# EAGLE design sentinel psionic (EAGLE 9.2.0)
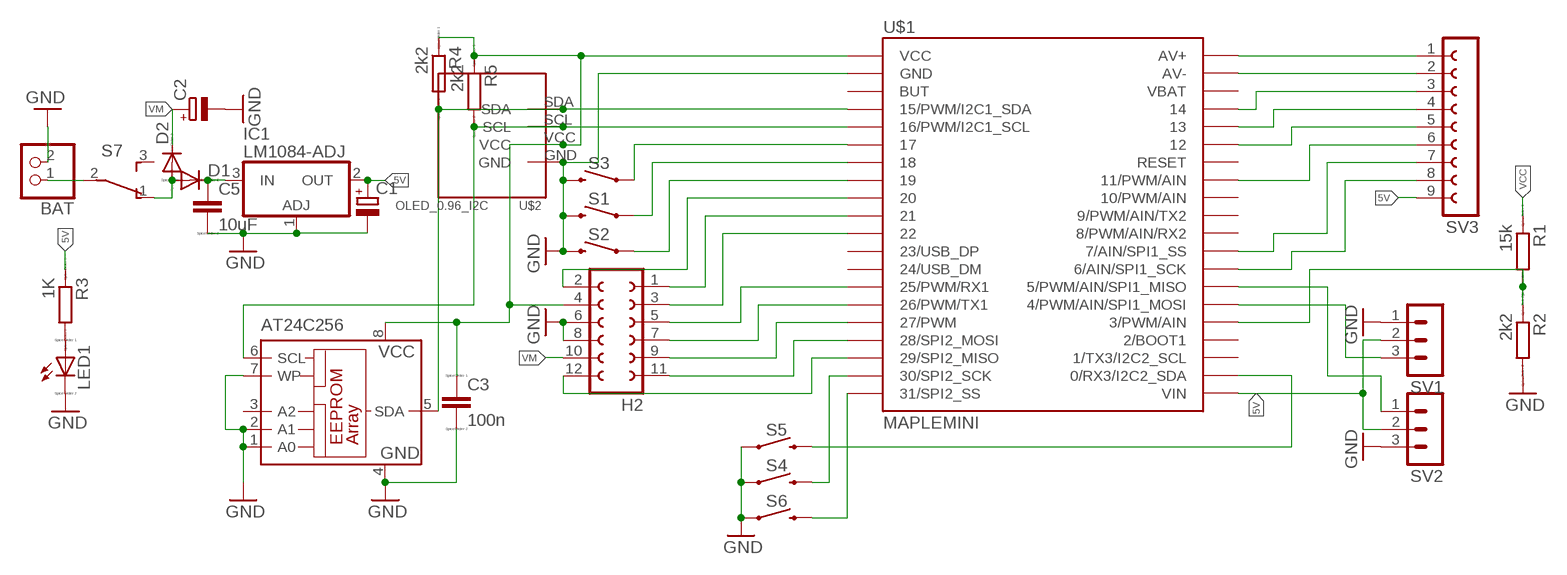
[diagram p0: schematic, sheet 1]

## Parts
AT24C256  24AA01SN  [SO-08]
BAT  PINHD-1X2  [1X02]
C1  CPOL-EU153CLV-0605  [153CLV-0605]
C2  CPOL-EU153CLV-0605  [153CLV-0605]
C3  100n  CC1206  [C1206]
C5  10uF  CC1206  [C1206]
D1  DIODE-DO-214AC  [DO-214AC]
D2  DIODE-DO-214AC  [DO-214AC]
H2  FE06-2  [FE06-2]
IC1  LM1084-ADJ  [TO263-3]
LED1  LED_E  [LED_1206]
R1  15k  RR1206  [R1206]
R2  2k2  RR1206  [R1206]
R3  1K  RR1206  [R1206]
R4  2k2  RR1206  [R1206]
R5  2k2  RR1206  [R1206]
S1  MOMENTARY-SWITCH-SPST-SMD-6.0X3.5MM  [TACTILE_SWITCH_SMD_6.0X3.5MM]
S2  MOMENTARY-SWITCH-SPST-SMD-6.0X3.5MM  [TACTILE_SWITCH_SMD_6.0X3.5MM]
S3  MOMENTARY-SWITCH-SPST-SMD-6.0X3.5MM  [TACTILE_SWITCH_SMD_6.0X3.5MM]
S4  MOMENTARY-SWITCH-SPST-SMD-6.0X3.5MM  [TACTILE_SWITCH_SMD_6.0X3.5MM]
S5  MOMENTARY-SWITCH-SPST-SMD-6.0X3.5MM  [TACTILE_SWITCH_SMD_6.0X3.5MM]
S6  MOMENTARY-SWITCH-SPST-SMD-6.0X3.5MM  [TACTILE_SWITCH_SMD_6.0X3.5MM]
S7  TL36PO  [TL3XPO]
SV1  MA03-1  [MA03-1]
SV2  MA03-1  [MA03-1]
SV3  FE09-1  [FE09]
U$1  MAPLEMINI  [20-DIP]
U$2  OLED_0.96_I2C  [OLED_0.96_I2C]

## Nets
5V: C1.+ IC1.2(OUT) R3.1 SV1.2 SV2.2 SV3.9 U$1.21(VIN)
5V1: AT24C256.8(VCC) C3.1 H2.4 R4.1 R5.1 U$1.1(VCC) U$2.VCC
+: BAT.1 S7.2(P)
GND: AT24C256.1(A0) AT24C256.2(A1) AT24C256.4(GND) AT24C256.7(WP) BAT.2 C1.- C2.- C3.2 C5.2 H2.6 H2.8 IC1.1(ADJ) LED1.C R2.2 S1.2 S2.2 S3.2 S4.1 S5.1 S6.1 SV1.1 SV2.3 U$1.2(GND) U$2.GND
N$1: R1.2 R2.1 U$1.25(3/PWM/AIN)
N$2: AT24C256.5(SDA) R4.2 U$1.4(15/PWM/I2C1_SDA) U$2.SDA
N$3: LED1.A R3.2
N$4: SV3.8 U$1.28(6/AIN/SPI1_SCK)
N$5: SV3.1 U$1.40(AV+)
N$6: SV3.2 U$1.39(AV-)
N$7: SV3.3 U$1.37
N$8: SV3.4 U$1.36
N$9: SV3.5 U$1.35
N$10: SV3.6 U$1.33(11/PWM/AIN)
N$11: SV3.7 U$1.29(7/AIN/SPI1_SS)
N$17: S3.1 U$1.6
N$18: S1.1 U$1.7
N$19: S2.1 U$1.8
N$20: S6.2 U$1.20(31/SPI2_SS)
N$21: S4.2 U$1.19(30/SPI2_SCK)
N$22: S5.2 U$1.22(0/RX3/I2C2_SDA)
N$24: C5.1 D1.C IC1.3(IN)
N$25: H2.2 U$1.9
N$26: SV2.1 U$1.27(5/PWM/AIN/SPI1_MISO)
N$27: SV1.3 U$1.26(4/PWM/AIN/SPI1_MOSI)
N$28: H2.1 U$1.10
N$29: H2.11 U$1.17(28/SPI2_MOSI)
N$30: H2.12 U$1.18(29/SPI2_MISO)
N$31: H2.3 U$1.11
N$32: H2.5 U$1.14(25/PWM/RX1)
N$33: H2.7 U$1.15(26/PWM/TX1)
N$34: H2.9 U$1.16(27/PWM)
N$36: AT24C256.6(SCL) R5.2 U$1.5(16/PWM/I2C1_SCL) U$2.SCL
VCC: D1.A D2.A R1.1 S7.1(O)
VM: C2.+ D2.C H2.10
Unconnected: AT24C256.3(A2) S7.3(S) U$1.3(BUT) U$1.12(23/USB_DP) U$1.13(24/USB_DM) U$1.23(1/TX3/I2C2_SCL) U$1.24(2/BOOT1) U$1.30(8/PWM/AIN/RX2) U$1.31(9/PWM/AIN/TX2) U$1.32(10/PWM/AIN) U$1.34(RESET) U$1.38(VBAT)

## Library data of the parts
AT24C256 = microchip:24*: Serial EEPROM I2C; MF: MICROCHIP; MPN: 24AA01/SN; OC_FARNELL: 1331268; OC_NEWARK: 89C9792
BAT = pinhead:PINHD-1X2: PIN HEADER
C1 C2 = resistor:CPOL-EU: POLARIZED CAPACITOR, European symbol
C3 C5 = eagle-ltspice:C: CAPACITOR, European symbol; SPICEMODEL: NONE; SPICEPREFIX: C
D1 D2 = diode:DIODE-: DIODE
H2 = con-lsta:FE06-2: FEMALE HEADER; OC_FARNELL: unknown; OC_NEWARK: unknown
IC1 = lm1084:LM1084-ADJ: LM1084-ADJ 5A 29V - Voltage Regulator Autor: Cleber Moretti Web site: http://www.binarycodec.blogspot.com v.1.2
LED1 = eagle-ltspice:LED_E: LED Source: http://www.osram.convergy.de Source: www.luxeon.com Source: www.kingbright.com; SPICEMODEL: NONE; SPICEPREFIX: D; SPICETYPE: diode
R1-R5 = eagle-ltspice:R: RESISTOR, European symbol; SPICEMODEL: NONE; SPICEPREFIX: R
S1-S6 = button:MOMENTARY-SWITCH-SPST: Momentary Switch (Pushbutton) - SPST Normally-open (NO) SPST momentary switches (buttons, pushbuttons). Variants PTH-12MM - 12mm square, through-hole Momentary Pushbutton Switch - 12mm Square <https://www.sparkfun.com/products/9190> (COM-09190) PTH-6.0MM, PTH-6.0MM-KIT - 6.0mm square, through-hole Mini Pushbutton Switch <https://www.sparkfun.com/products/97> (COM-00097) KIT package intended for soldering kit's - only one side of pads' copper is exposed. PTH-RIGHT-ANGLE-KIT - Right-angle, through-hole Right Angle Tactile Button <https://www.sparkfun.com/products/10791> - Used on SparkFun BigTime Watch Kit <https://www.sparkfun.com/products/11734> SMD-12MM - 12mm square, surface-mount Tactile Button - SMD (12mm) <https://www.sparkfun.com/products/12993> (COM-12993) Used on SparkFun PicoBoard <https://www.sparkfun.com/products/11888> SMD-4.5MM - 4.5mm Square Trackball Switch Used on SparkFun Blackberry Trackballer Breakout <https://www.sparkfun.com/products/13169> SMD-4.6MMX2.8MM - 4.60mm x 2.80mm, surface mount Used on SparkFun SAMD21 Mini Breakout <https://www.sparkfun.com/products/13664> SMD-5.2MM, SMD-5.2-REDUNDANT - 5.2mm square, surface-mount Mini Pushbutton Switch - SMD <https://www.sparkfun.com/products/8720> (COM-08720) Used on Arduino Pro Mini <https://www.sparkfun.com/products/11114> REDUNDANT package connects both switch circuits together SMD-6.0X3.5MM - 6.0 x 3.5mm, surface mount Momentary Reset Switch SMD <https://www.sparkfun.com/products/8229> (COM-08229) SMD-6.2MM-TALL - 6.2mm square, surface mount Tactile Button - SMD (6mm) <https://www.sparkfun.com/products/12992> Used on SparkFun Digital Sandbox <https://www.sparkfun.com/products/12651> SMD-RIGHT-ANGLE - Right-angle, surface mount Used on SparkFun Block for Intel� Edison - Arduino <https://www.sparkfun.com/products/13036>; PROD_ID: SWCH-00815; SF_SKU: COM-08229
S7 = switch:TL36PO: TINY SWITCH ON - ON Source: http://www2.produktinfo.conrad.com/datenblaetter/700000-724999/705152-da-01-de-Subminiaturschalter_TL_36YO.pdf
SV1 SV2 = con-lstb:MA03-1: PIN HEADER; OC_FARNELL: unknown; OC_NEWARK: unknown
SV3 = con-lsta:FE09-1: FEMALE HEADER; OC_FARNELL: unknown; OC_NEWARK: unknown
U$1 = maplemini:MAPLEMINI
U$2 = oled_0.96:OLED_0.96_I2C

## Board
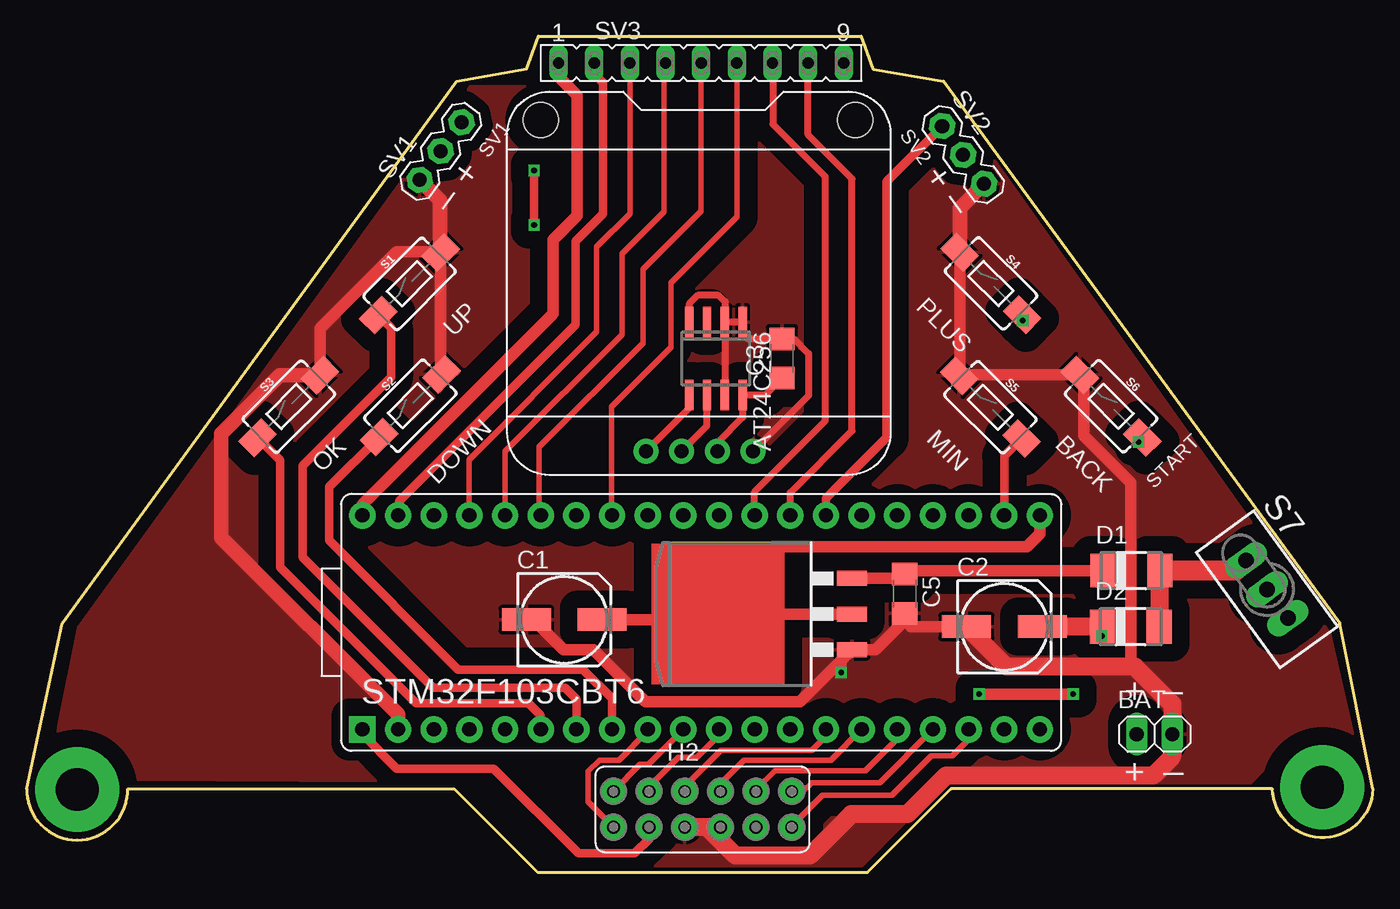
[diagram p1: board, top side]
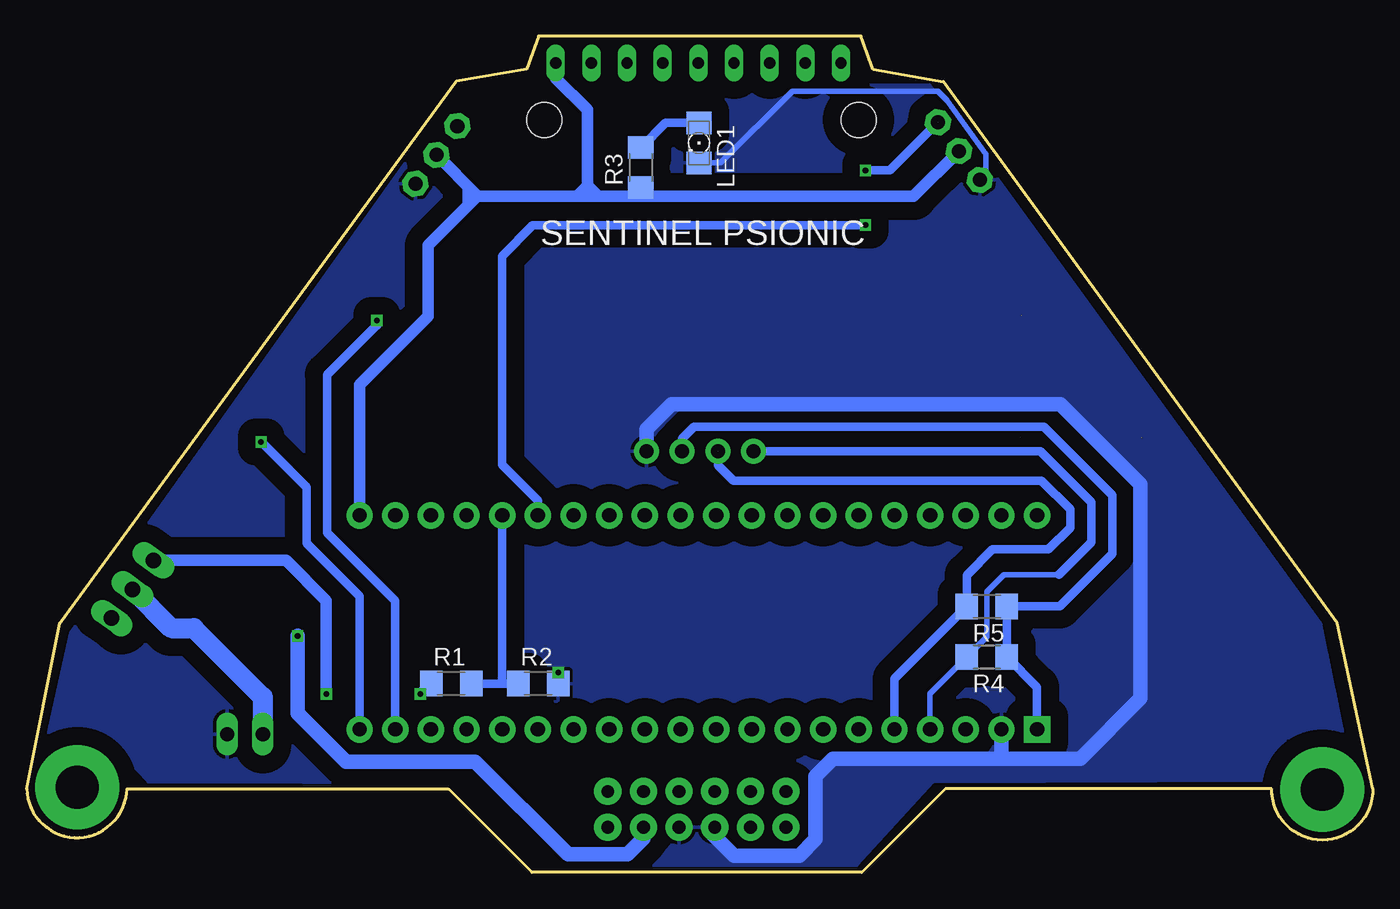
[diagram p2: board, bottom side, seen from below]

No outline drawn. Coordinates in mm, seen from the top.
Copper layers (1*16): Top 0.035mm / dielectric 1.5mm / Bottom 0.035mm
Design rules "default": minimum track width 10mil, minimum drill 24mil, track to track 8mil, track to pad 8mil, pad to pad 8mil, via to via 8mil, smd to smd 8mil, copper to edge 40mil, drill to drill 8mil, minimum pad ring 10mil, minimum via ring 8mil, stop-mask expansion 4mil, vias tented up to drill 0mil, thermal gap 10mil
Milling: 16 lines

### Footprints (pad centres in the part's own frame; a part is rotated, then mirrored left to right if it is on the bottom)
SO-08 = smd 0.6 x 2.2: 1 -1.905,-2.6; 2 -0.635,-2.6; 3 0.635,-2.6; 4 1.905,-2.6; 5 1.905,2.6; 6 0.635,2.6; 7 -0.635,2.6; 8 -1.905,2.6
1X02 = drill 1.016 long: 1 -1.27,0; 2 1.27,0
153CLV-0605 = smd 3.5 x 1.6: + 2.7,0; - -2.7,0
C1206 = smd 1.6 x 1.8: 1 -1.4,0; 2 1.4,0
DO-214AC = smd 1.8 x 2.4: A 2.025,0; C -2.025,0
FE06-2 = drill 0.914 pad 1.93: 1 -6.35,1.27; 2 -6.35,-1.27; 3 -3.81,1.27; 4 -3.81,-1.27; 5 -1.27,1.27; 6 -1.27,-1.27; 7 1.27,1.27; 8 1.27,-1.27; 9 3.81,1.27; 10 3.81,-1.27; 11 6.35,1.27; 12 6.35,-1.27
TO263-3 = smd 1.067 x 2.159: 1 -2.54,-5.791; 2 0,-5.791; 3 2.54,-5.791
LED_1206 = smd 1.6 x 1.803: A -1.422,0; C 1.422,0
R1206 = smd 1.6 x 1.803: 1 -1.422,0; 2 1.422,0
TACTILE_SWITCH_SMD_6.0X3.5MM = smd 2.3 x 1.6: 1 -3.15,0; 2 3.15,0
TL3XPO = drill 1.1 pad 1.422 long: 1 -2.54,0; 2 0,0; 3 2.54,0
MA03-1 = drill 1 pad 1.8 octagon: 1 -2.54,0; 2 0,0; 3 2.54,0
FE09 = drill 0.813 long: 1 -10.16,0; 2 -7.62,0; 3 -5.08,0; 4 -2.54,0; 5 0,0; 6 2.54,0; 7 5.08,0; 8 7.62,0; 9 10.16,0
20-DIP = drill 1.016 pad 1.88 square: 1 -24.13,-7.62 | drill 1.016 pad 1.88: 2 -21.59,-7.62; 3 -19.05,-7.62; 4 -16.51,-7.62; 5 -13.97,-7.62; 6 -11.43,-7.62; 7 -8.89,-7.62; 8 -6.35,-7.62; 9 -3.81,-7.62; 10 -1.27,-7.62; 11 1.27,-7.62; 12 3.81,-7.62; 13 6.35,-7.62; 14 8.89,-7.62; 15 11.43,-7.62; 16 13.97,-7.62; 17 16.51,-7.62; 18 19.05,-7.62; 19 21.59,-7.62; 20 24.13,-7.62; 21 24.13,7.62; 22 21.59,7.62; 23 19.05,7.62; 24 16.51,7.62; 25 13.97,7.62; 26 11.43,7.62; 27 8.89,7.62; 28 6.35,7.62; 29 3.81,7.62; 30 1.27,7.62; 31 -1.27,7.62; 32 -3.81,7.62; 33 -6.35,7.62; 34 -8.89,7.62; 35 -11.43,7.62; 36 -13.97,7.62; 37 -16.51,7.62; 38 -19.05,7.62; 39 -21.59,7.62; 40 -24.13,7.62
OLED_0.96_I2C = drill 1 pad 1.778: GND -4.17,11.63; SCL 0.91,11.63; SDA 3.45,11.63; VCC -1.63,11.63 | hole 2.5: -11.47,-11.97; 10.93,-11.97

### Placement (x,y rotation side)
AT24C256  61.3,36 180 top
BAT  92.55,9.25 0 top
C1  50.5,17.4 0 top
C2  81.85,16.9 0 top
C3  66,36 90 top
C5  74.75,19.25 270 top
D1  90.9,20.9 0 top
D2  90.85,16.9 0 top
H2  60.35,3.9 0 top
IC1  65.2,17.8 90 top
LED1  60.2,51.35 270 bottom
R1  77.85,12.85 0 bottom
R2  71.65,12.85 0 bottom
R3  64.35,49.6 90 bottom
R4  39.7,14.75 180 bottom
R5  39.7,18.35 180 bottom
S1  39.47,41.32 45 top
S2  39.53,32.64 45 top
S3  30.87,32.58 45 top
S4  80.9,41.34 315 top
S5  80.85,32.53 315 top
S6  89.45,32.6 315 top
S7  100.56,19.57 306 top
SV1  41.69,50.77 54 top
SV2  78.91,50.5 306 top
SV3  60.25,57.05 0 top
U$1  60.25,17.21 0 top
U$2  59.77,41.03 180 top

### Tracks (layer width: path | path; a pad name or v marks a point on that pad's centre or on a via)
5V
  Top 0.813: U$1.21 84.38,23.53 83.45,22.6 65.35,22.6 65.35,18.15 | IC1.2 65.7,17.8 65.35,18.15 | C1.+ 64.6,17.4 65.35,18.15
  Bottom 0.61: 76.75,48.3 76.75,46.8 | R3.1 64.35,47.7 64.5,47.55 | 67.25,47.55 68.15,48.45 69.05,47.55
  Bottom 0.813: SV1.2 44.91,47.55 64.5,47.55 67.25,47.55 68.25,47.55 | SV2.2 76,47.59 76,47.55 | 68.25,47.55 69.05,47.55 76,47.55 | U$1.21 84.38,34.12 79.5,39 79.5,44.05 76.75,46.8 76,47.55 | SV3.9 70.41,55.96 68.15,53.7 68.15,48.45 68.15,47.65 68.25,47.55
5V1
  Top 0.508: C3.1 64.8,33.4 AT24C256.8 63.2,31.8 61.4,30 U$2.VCC
  Top 0.61: U$1.1 36.12,9.23 38.55,6.8 45.45,6.8 51.5,0.75 55.5,0.75 56.6,1.85 56.6,2.57 H2.4
  Bottom 0.61: U$2.VCC 61.4,30.3 60.55,31.15 35.65,31.15 30.75,26.25 30.75,22.1 34.5,18.35 R5.1 R4.1 36.12,12.59 U$1.1
+
  Bottom 1.422: BAT.1 91.28,11.88 96.2,16.8 97.79,16.8 S7.2
GND  (via drill 0.4)
  Top 0.508: AT24C256.2 AT24C256.1 63.2,37.8 63.6,37.4 C3.2 66.85,37.4 67.9,36.35 67.9,33.36 U$2.GND | AT24C256.4 59.4,39.9 60,40.5 61.5,40.5 61.95,40.05 61.95,38.62 AT24C256.2 | AT24C256.2 AT24C256.7
  Top 0.813: C5.2 74.75,17.35 | 74.75,17.35 72.65,15.25 71,15.25 | 71,15.25 IC1.1 | C2.- 75.2,16.9 74.75,17.35 | S4.1 78.67,34.81 S5.1 78.69,34.83 S6.1 87.5,34.55 87.5,30.5 90.85,27.15 90.85,14.05 | S2.2 41.7,34.93 S1.2 41.64,43.6 38.55,43.6 33.1,38.15 S3.2 | C1.- 48.3,17.4 50.45,15.25 52.6,15.25 56.3,11.55 67.28,11.55 IC1.1 71,15.25 | v70.22,13.63 70.22,14.46 71,15.25
  Top 1.016: S4.1 78.67,46.71 SV2.3 | 41.64,43.6 41.64,47.27 SV1.1 | S3.2 30.2,34.8 26.05,30.65 26.05,23.25 38.65,10.65 U$1.2
  Top 1.27: H2.8 H2.6 60.67,2.63 62.7,0.6 68,0.6 70.95,3.55 74.95,3.55 77.7,6.3 92.45,6.3 93.8,7.65 93.8,9.23 BAT.2 93.82,11.38 91.15,14.05 90.85,14.05 82,14.05 C2.-
  Bottom 0.406: LED1.C 58.67,49.93 53.55,55.05 43.2,55.05 42.55,54.4 39.75,50.55 39.75,49.16 SV1.1
  Bottom 0.61: R2.2 v70.23,13.62 v70.22,13.63
  Bottom 1.016: U$1.2 38.66,7.55 | 38.66,7.55 38.66,7.5 50.65,7.5 51.9,6.25 51.9,1.75 53.05,0.6 57.7,0.6 59.2,2.1 59.2,2.51 H2.6 | U$2.GND 63.94,30.96 62.15,32.75 34.45,32.75 28.75,27.05 28.75,11.8 33.05,7.5 38.61,7.5 38.66,7.55
  pour Top (isolate 1.27): 14.5,9.8 15.9,16.9 43.8,55.4 77.35,55.45 105,16.5 106.7,9.05 102.5,8.95 99.4,5.75 77.5,5.7 71.7,-0.15 48.95,-0.2 43.65,5.85 19.65,6 18.2,9 14.4,9.1
  pour Bottom (isolate 1.27): 48.95,-0.1 43.5,5.85 19.6,5.95 18.35,9 14.25,8.95 15.9,17.1 43.8,55.5 77.2,55.45 105,16.45 106.65,9.05 102.5,9.05 99.45,5.85 77.45,5.8 71.75,-0.1
N$1
  Bottom 0.61: 73.15,12.93 R2.1 74.35,12.85 | R1.2 74.35,12.85 | U$1.25 74.25,24.8 74.25,12.95 74.35,12.85
N$2
  Top 0.508: U$2.SDA 59.4,32.48 AT24C256.5
  Bottom 0.406: U$1.4 43.74,12.13 R4.2 39.7,16.17 39.7,19.4 38.5,20.6 34.55,20.6
  Bottom 0.61: 34.55,20.6 32.25,22.9 32.25,25.75 35.9,29.4 U$2.SDA
N$3
  Bottom 0.61: LED1.A 62.6,52.77 R3.2
N$4
  Top 0.508: U$1.28 66.6,26.45 71,30.85 71,48.8 67.87,51.93 SV3.8
N$5
  Top 0.813: U$1.40 36.12,25.62 49.7,39.2 49.7,44.45 51.4,46.15 51.4,54.75 50.1,56.05 SV3.1
N$6
  Top 0.61: U$1.39 38.75,24.92 38.75,25.85 51.3,38.4 51.3,44.35 53.25,46.3 53.25,55.65 52.75,56.15 52.75,56.93 SV3.2
N$7
  Top 0.406: SV3.3 55.17,46.32 52.8,43.95 52.8,37.9 43.7,28.8 43.7,24.87 U$1.37
N$8
  Top 0.406: U$1.36 46.28,29.38 54.6,37.7 54.6,43.45 57.6,46.45 57.6,56.94 SV3.4
N$9
  Top 0.406: SV3.5 60.25,46.5 56.1,42.35 56.1,37.1 48.7,29.7 48.7,24.95 U$1.35
N$10
  Top 0.406: SV3.6 62.79,46.09 58.1,41.4 58.1,36.8 53.85,32.55 53.85,24.88 U$1.33
N$11
  Top 0.406: 65.35,57.03 SV3.7
  Top 0.508: 65.35,57.03 65.35,52.7 69.1,48.95 69.1,31.55 64.06,26.51 U$1.29
N$17  (1 unrouted)
  Top 0.61: S3.1 30.25,28.74 30.25,21.15 39.95,11.45 47.95,11.45 48.82,10.58 U$1.6
N$18  (1 unrouted)
  Top 0.61: S1.1 38.15,38.18 38.15,34.65 31.85,28.35 31.85,21.85 41.15,12.55 50.55,12.55 51.36,11.74 U$1.7
N$19  (1 unrouted)
  Top 0.61: S2.1 33.75,26.86 33.75,23.95 33.75,23.05 42.95,13.85 51.85,13.85 53.9,11.8 U$1.8
N$20  (via drill 0.4)
  Top 0.61: v91.4,30.05 S6.2
  Bottom 0.61: v91.4,30.05 91.25,29.94 88.15,26.84 88.15,22.85 84.38,19.08 U$1.20
N$21  (via drill 0.4)
  Top 0.61: v83.15,38.7 83.15,39.09 S4.2
  Bottom 0.61: U$1.19 81.85,18.75 86.7,23.6 86.7,34.85 83.15,38.4 v83.15,38.7 83.12,38.32
N$22
  Top 0.61: S5.2 81.84,29.07 U$1.22
N$24
  Top 0.813: IC1.3 74.61,20.34 C5.1 75.45,20.9 D1.C
N$25
  Top 0.406: U$1.9 56.44,9.44 54.4,7.4 53,7.4 52.2,6.6 52.2,4.43 H2.2
N$26
  Top 0.61: U$1.27 69.14,26.04 73.45,30.35 73.45,48.58 SV2.1
N$27  (via drill 0.4)  (1 unrouted)
  Top 0.61: v48.35,49.4 v48.35,45.5
  Bottom 0.61: v48.35,45.5 72.05,45.5 74.25,43.3 74.25,28.45 71.68,25.88 U$1.26 | v48.35,49.4 46.61,49.4 SV1.3
N$28
  Top 0.406: U$1.10 56.49,7.1 55.9,7.1 54,5.2 H2.1
N$29
  Top 0.406: H2.11 67.52,5.17 68.15,5.8 72.97,5.8 U$1.17
N$30
  Top 0.406: H2.12 66.7,2.7 68.9,4.9 73.85,4.9 76.65,7.7 78.15,7.7 79.3,8.85 U$1.18
N$31
  Top 0.406: U$1.11 61.52,9.17 59.95,7.6 58.62,7.6 56.54,5.52 H2.3
N$32
  Top 0.406: U$1.14 69.14,9.09 68.15,8.1 61.66,8.1 59.08,5.52 H2.5
N$33
  Top 0.406: U$1.15 69.49,7.4 63.3,7.4 61.65,5.75 61.65,5.2 H2.7
N$34
  Top 0.406: U$1.16 74.22,8.92 71.95,6.65 65.5,6.65 64.16,5.31 H2.9
N$36  (1 unrouted)
  Top 0.508: U$2.SCL 60.66,31.2 AT24C256.6
  Bottom 0.406: U$2.SCL
  Bottom 0.61: U$2.SCL 58.85,28.4 57.75,27.3 35.8,27.3 33.75,25.25 33.75,23.95 35.3,22.4 39.3,22.4 41.12,20.58 R5.2 46.28,13.19 U$1.5
N$79  (via drill 3.05 pad 6)
  other vias: 15.8,5.31
N$80  (via drill 3.05 pad 6)
  other vias: 104.5,5.46
VCC  (via drill 0.4)
  Top 0.813: v86.75,12.1 v80.05,12.1
  Top 1.27: D1.A 92.88,20.85 D2.A | S7.1 98.34,20.9
  Top 1.422: 98.34,20.9 D1.A
  Bottom 0.813: S7.1 89.62,21.62 86.75,18.75 v86.75,12.1 | v80.05,12.1 80.02,12.1 R1.1
VM  (via drill 0.4)
  Top 1.016: v88.8,16.25 88.83,16.27 D2.C
  Top 1.27: D2.C C2.+
  Bottom 1.016: H2.10 64.16,1.84 65.3,0.7 69.55,0.7 76.15,7.3 85.35,7.3 88.8,10.75 v88.8,16.25

### Text on the board
tPlace: SV2 | SV1 | + | + | _ | _ | PLUS | UP | MIN | BACK | OK | DOWN | START | _ | STM32F103CBT6 | + | _ | +
bPlace: SENTINEL PSIONIC